# EasyEDA schematic QuadV3.json
TITLE: Sheet_1; REV: 1.0; Date: 2023-09-13; Sheet: 1/1; Drawn By: townlake101; Company: Your Company
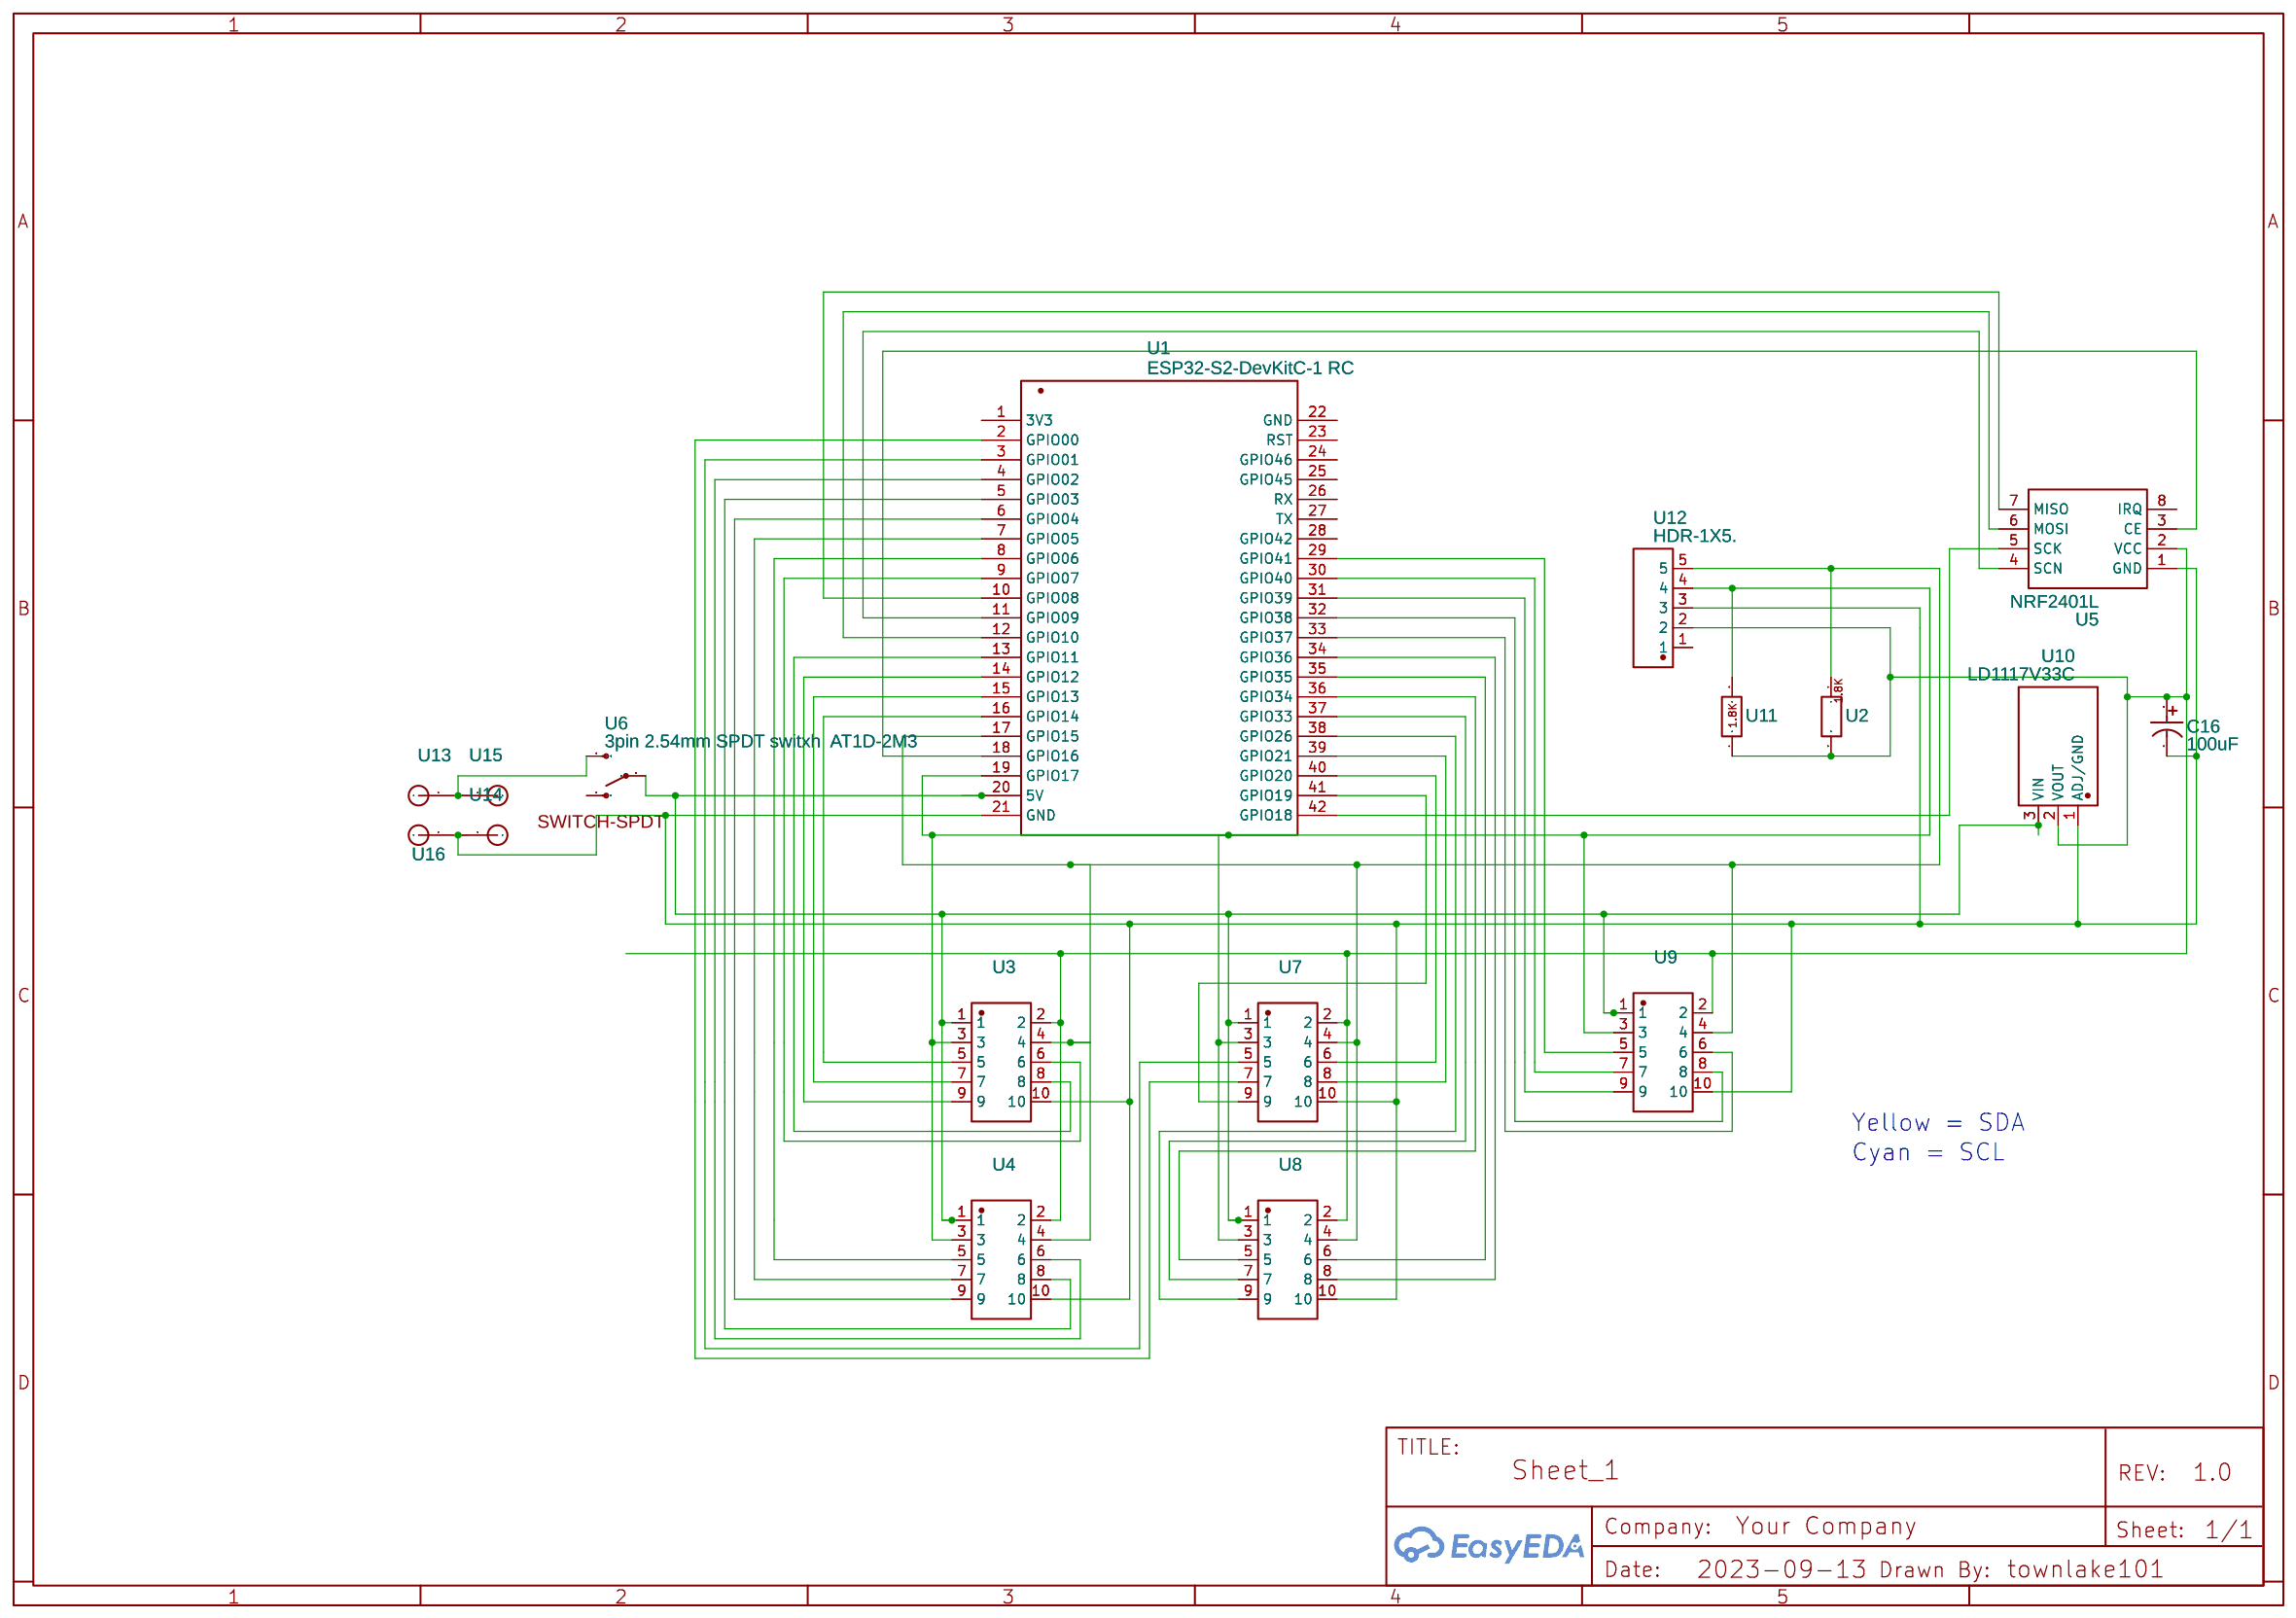
[diagram p0: schematic sheet]

## Parts
C16  100uF  [100UFX16V CAPACITOR D5.0XF11.0]
U1  ESP32-S2-DevKitC-1 RC  [ESP32-S2-DEVKITC-1]
U2  NO  [1.8K RESISTOR 1/2W]
U3  NO  [CONN-TH_10P-P2.54_KINGHELM_KH-2.54PH180-2X5P-L8.9]
U4  NO  [CONN-TH_10P-P2.54_KINGHELM_KH-2.54PH180-2X5P-L8.9]
U5  NRF2401L  [NRF2401L]
U6  3pin 2.54mm SPDT switxh  AT1D-2M3  [SPDT 3PIN 2.54MM SWITCH]
U7  NO  [CONN-TH_10P-P2.54_KINGHELM_KH-2.54PH180-2X5P-L8.9]
U8  NO  [CONN-TH_10P-P2.54_KINGHELM_KH-2.54PH180-2X5P-L8.9]
U9  NO  [CONN-TH_10P-P2.54_KINGHELM_KH-2.54PH180-2X5P-L8.9]
U10  LD1117V33C  [ITO-220AB-3_L10.2-W4.5-P2.60-L]
U11  NO  [1.8K RESISTOR 1/2W]
U12  HDR-1X5.  [CONN-TH_HDR-1X5]
U13  NO  [14AWG PTH LARGE]
U14  NO  [14AWG PTH LARGE]
U15  NO  [14AWG PTH LARGE]
U16  NO  [14AWG PTH LARGE]

## Library data of the parts
C16 = CAP-POL-1: Supplier: My_collection; Manufacturer Part: Jweo; Rated Voltage: 16V; Contributor: stefanczykdk
U1 = ESP32-S2-DevKitC-1 RC: Manufacturer: Espressif Manifacturer; Manufacturer Part: ESP32-S2-DevKitC-1; Supplier: Mouser; Supplier Part: ESP32-S2-DevKitC-1; link: https://www.espressif.com/en/products/socs/esp32-s2; Contributor: remi_chamb
U2 U11 = 1.8K_R_1/2W: Contributor: jokosays
U3 U4 U7-U9 = KH-2.54PH180-2X5P: Supplier: LCSC; Supplier Part: C5157628; Manufacturer: kinghelm(金航标); Manufacturer Part: KH-2.54PH180-2X5P-L8.9; link: https://atta.szlcsc.com/upload/public/pdf/source/20220906/04BEB622ED10B556BB25C8F90E10FD05.pdf; Contributor: lcsc; JLCPCB Part Class: Extended Part
U5 = NRF2401L: Manufacturer Part: nrf2401l; Contributor: freddyka
U6 = 3pin 2.54mm SPDT switxh  AT1D-2M3: Contributor: Tellon
U10 = LD1117V33C: Contributor: LCSC; Supplier: LCSC; Supplier Part: C672117; Manufacturer: ST(意法半导体); JLCPCB Part Class: Extended Part; link: https://lcsc.com/eda_search?q=C672117&%26type=1&ref=editor
U12 = HDR-1X5.: Contributor: LCSC; Supplier: LCSC; Supplier Part: C2935751; Manufacturer: null; Manufacturer Part: HDR-1X5插件; JLCPCB Part Class: Extended Part; link: https://lcsc.com/eda_search?q=C2935751&%26type=1&ref=editor
U13-U16 = Wire Hole 14AWG: Manufacturer Part: Wire Hole; Contributor: dropTarget

## Nets
Net-(C16-1): C16.1 U2.2 U3.2 U4.2 U5.2(VCC) U7.2 U8.2 U9.2 U10.2(VOUT) U11.1 U12.2
Net-(C16-2): C16.2 U1.21(GND) U3.10 U4.10 U5.1(GND) U7.10 U8.10 U9.10 U10.1(ADJ/GND) U12.3 U14.1 U16.1
Net-(U1-2): U1.2(GPIO00) U7.7
Net-(U1-3): U1.3(GPIO01) U7.5
Net-(U1-4): U1.4(GPIO02) U4.6
Net-(U1-5): U1.5(GPIO03) U4.8
Net-(U1-6): U1.6(GPIO04) U4.9
Net-(U1-7): U1.7(GPIO05) U4.7
Net-(U1-8): U1.8(GPIO06) U4.5
Net-(U1-9): U1.9(GPIO07) U3.6
Net-(U1-10): U1.10(GPIO08) U5.7(MISO)
Net-(U1-11): U1.11(GPIO09) U5.4(SCN)
Net-(U1-12): U1.12(GPIO10) U5.6(MOSI)
Net-(U1-13): U1.13(GPIO11) U3.8
Net-(U1-14): U1.14(GPIO12) U3.9
Net-(U1-15): U1.15(GPIO13) U3.7
Net-(U1-16): U1.16(GPIO14) U3.5
Net-(U1-17): U1.17(GPIO15) U2.1 U3.4 U4.4 U7.4 U8.4 U9.4 U12.5
Net-(U1-18): U1.18(GPIO16) U5.3(CE)
Net-(U1-19): U1.19(GPIO17) U3.3 U4.3 U7.3 U8.3 U9.3 U11.2 U12.4
Net-(U1-20): U1.20(5V) U3.1 U4.1 U6.2(P) U7.1 U8.1 U9.1 U10.3(VIN)
Net-(U1-29): U1.29(GPIO41) U9.5
Net-(U1-30): U1.30(GPIO40) U9.7
Net-(U1-31): U1.31(GPIO39) U9.9
Net-(U1-32): U1.32(GPIO38) U9.8
Net-(U1-33): U1.33(GPIO37) U9.6
Net-(U1-34): U1.34(GPIO36) U8.8
Net-(U1-35): U1.35(GPIO35) U8.6
Net-(U1-36): U1.36(GPIO34) U8.5
Net-(U1-37): U1.37(GPIO33) U8.7
Net-(U1-38): U1.38(GPIO26) U8.9
Net-(U1-39): U1.39(GPIO21) U7.8
Net-(U1-40): U1.40(GPIO20) U7.6
Net-(U1-41): U1.41(GPIO19) U7.9
Net-(U1-42): U1.42(GPIO18) U5.5(SCK)
Net-(U6-3): U6.3(S) U13.1 U15.1

Not connected (* = marked no-connect by the designer): U1 1(3V3) 22(GND) 23(RST) 24(GPIO46) 25(GPIO45) 26(RX) 27(TX) 28(GPIO42); U5 8(IRQ); U6 1(O); U12 1

## Notes on the sheet
- Yellow = SDA
- Cyan = SCL
